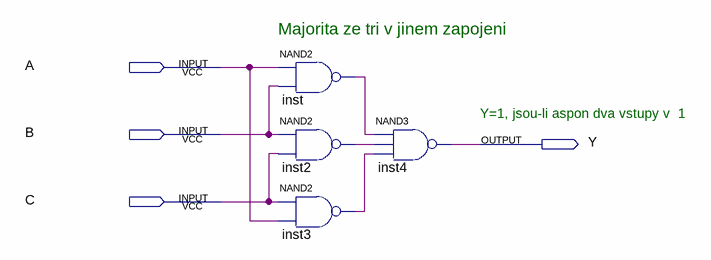
[diagram p0: schematic sheet]
// Quartus schematic majorita3n.bdf as structural Verilog: 4 symbols, 4 pins
module majorita3n (
  input  A,
  input  B,
  input  C,
  output Y
);

  wire inst2_out, inst3_out, inst_out;

  nand inst (inst_out, A, B);
  nand inst2 (inst2_out, B, C);
  nand inst3 (inst3_out, C, A);
  nand inst4 (Y, inst_out, inst2_out, inst3_out);

  // Notes on the sheet:
  //   Majorita ze tri v jinem zapojeni
  //   Y=1, jsou-li aspon dva vstupy v  1
endmodule
